# EAGLE design tsl3301cl_cs_mount (EAGLE 8.7.0)
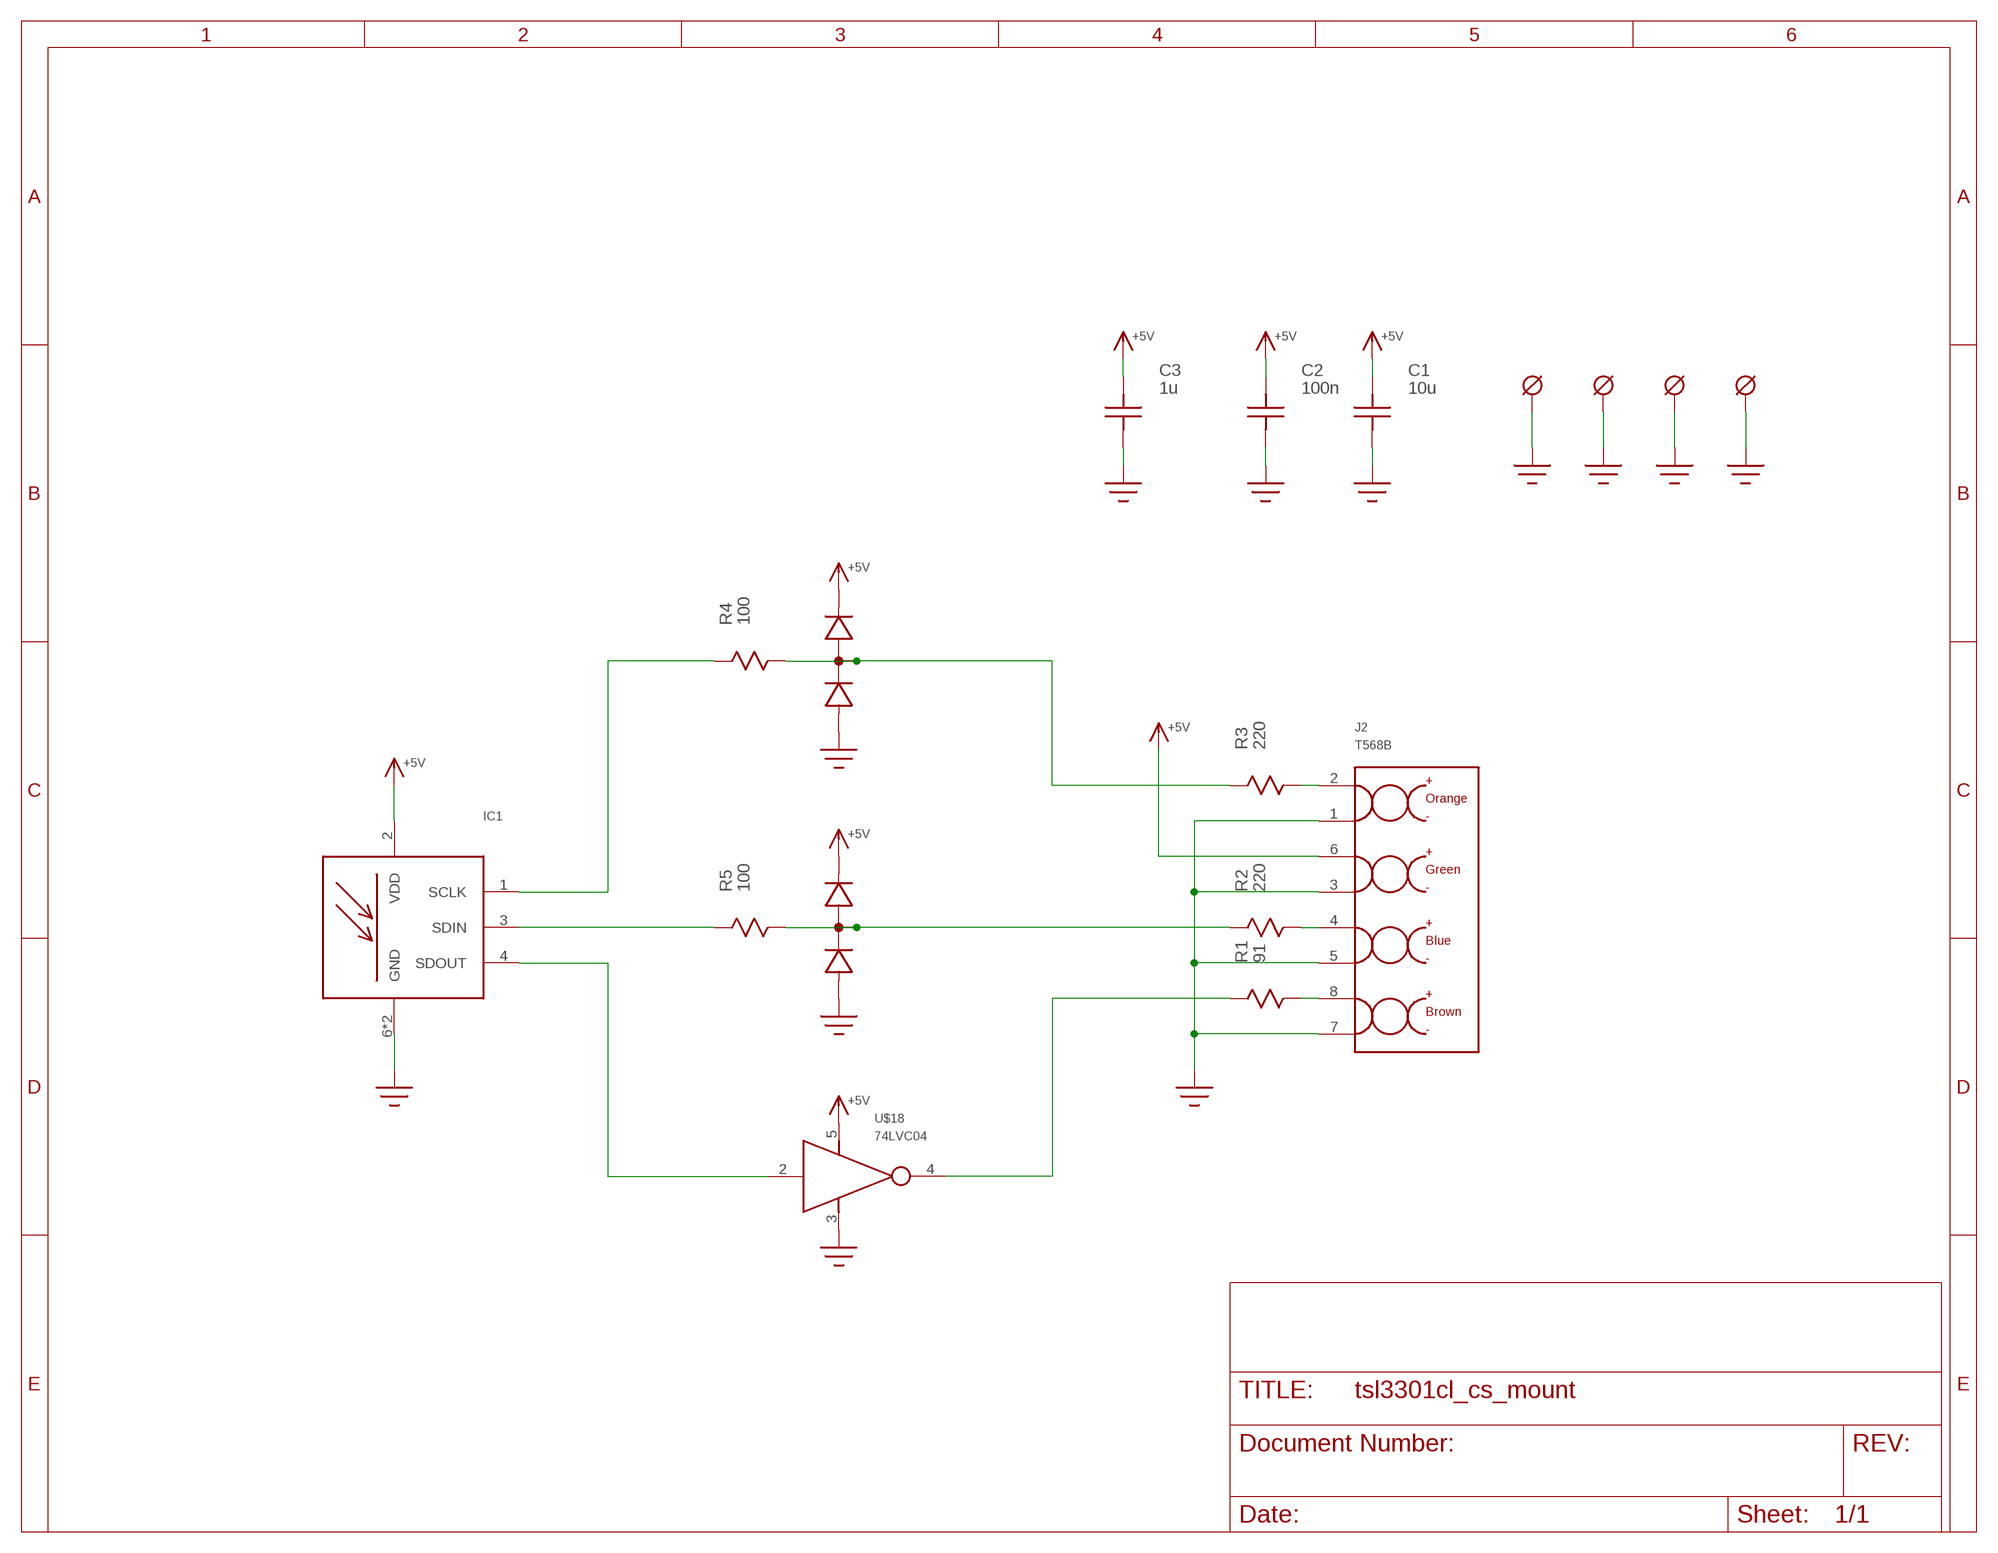
[diagram p0: schematic, sheet 1]

## Parts
C1  10u  C1206  [1206]
C2  100n  C0603  [C0603]
C3  1u  C0805  [0805]
IC1  TSL3301CL  [TSL3301]
J2  T568B  RJ45  [RJ45_KEYSTONE_949]
R1  91  R0805  [R0805]
R2  220  R0805  [R0805]
R3  220  R0805  [R0805]
R4  100  R0603  [R0603]
R5  100  R0603  [R0603]
U$2  MOUNTING_HOLE  [MOUNTING_HOLE_#4]
U$3  MOUNTING_HOLE  [MOUNTING_HOLE_#4]
U$4  MOUNTING_HOLE  [MOUNTING_HOLE_#4]
U$5  MOUNTING_HOLE  [MOUNTING_HOLE_#4]
U$18  74LVC04  [SOT23-5]
U$21  MMBD7000L  [SOT-23]
U$22  MMBD7000L  [SOT-23]

## Nets
+5V: C1.P$2 C2.P$2 C3.P$2 IC1.2(VDD) J2.6 U$18.5(VCC) U$21.2(CATHODE) U$22.2(CATHODE)
GND: C1.P$1 C2.P$1 C3.P$1 IC1.6(GND) IC1.7(GND) J2.1 J2.3 J2.5 J2.7 U$2.P$1 U$2.P$2 U$2.P$3 U$2.P$4 U$2.P$5 U$2.P$6 U$2.P$7 U$2.P$8 U$2.P$9 U$3.P$1 U$3.P$2 U$3.P$3 U$3.P$4 U$3.P$5 U$3.P$6 U$3.P$7 U$3.P$8 U$3.P$9 U$4.P$1 U$4.P$2 U$4.P$3 U$4.P$4 U$4.P$5 U$4.P$6 U$4.P$7 U$4.P$8 U$4.P$9 U$5.P$1 U$5.P$2 U$5.P$3 U$5.P$4 U$5.P$5 U$5.P$6 U$5.P$7 U$5.P$8 U$5.P$9 U$18.3(GND) U$21.1(ANODE) U$22.1(ANODE)
N$1: J2.8 R1.P$2
N$2: J2.2 R3.P$2
N$3: J2.4 R2.P$2
N$4: R1.P$1 U$18.4(OUT)
N$5: R2.P$1 R5.P$2 U$21.3(COMMON)
N$6: R3.P$1 R4.P$2 U$22.3(COMMON)
N$7: IC1.1(SCLK) R4.P$1
N$8: IC1.3(SDIN) R5.P$1
N$10: IC1.4(SDOUT) U$18.2(IN)

## Library data of the parts
C1-C3 = pancam:C
IC1 = pancam:TSL3301CL
J2 = pancam:RJ45
R1-R5 = pancam:R
U$2-U$5 = pancam:MOUNTING_HOLE
U$18 = pancam:74LVC04
U$21 U$22 = pancam:MMBD7000L

## Board
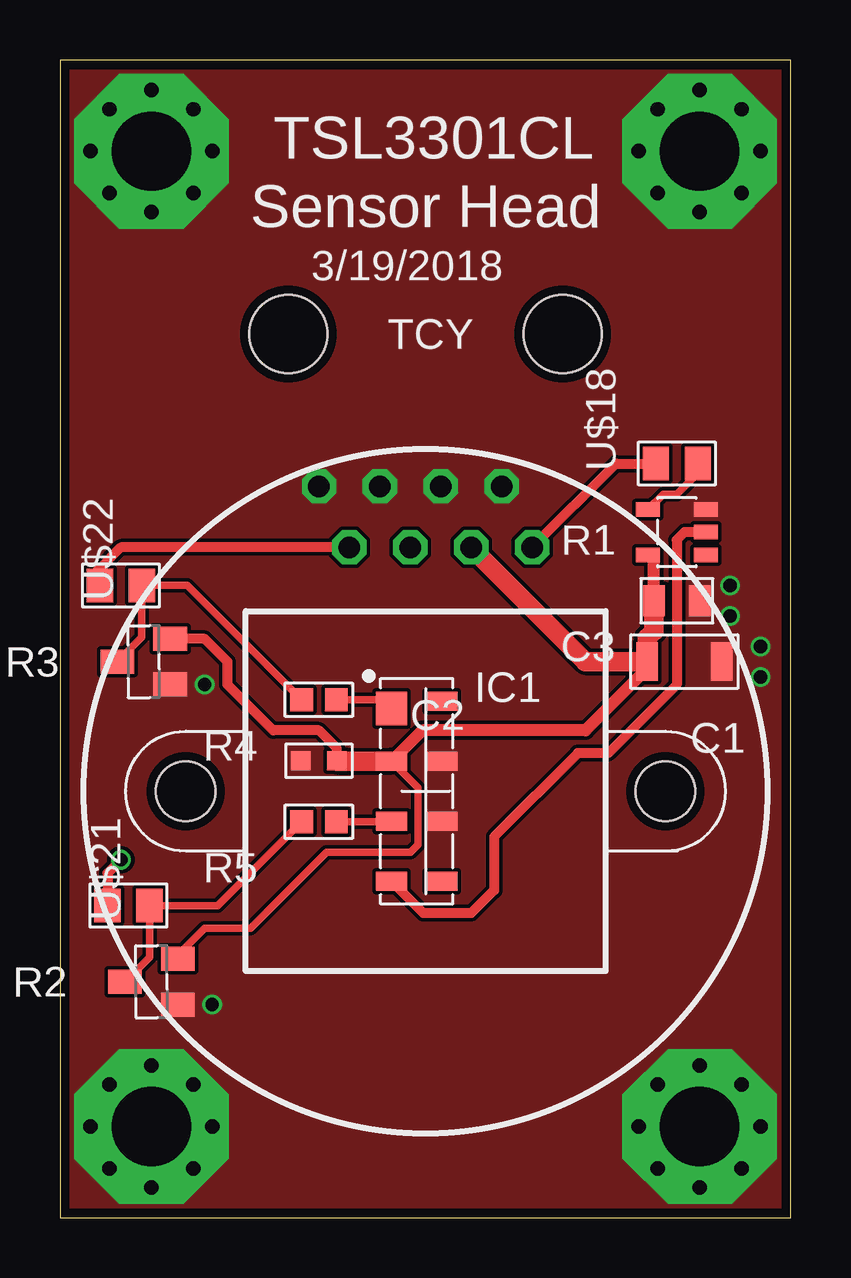
[diagram p1: board, top side]
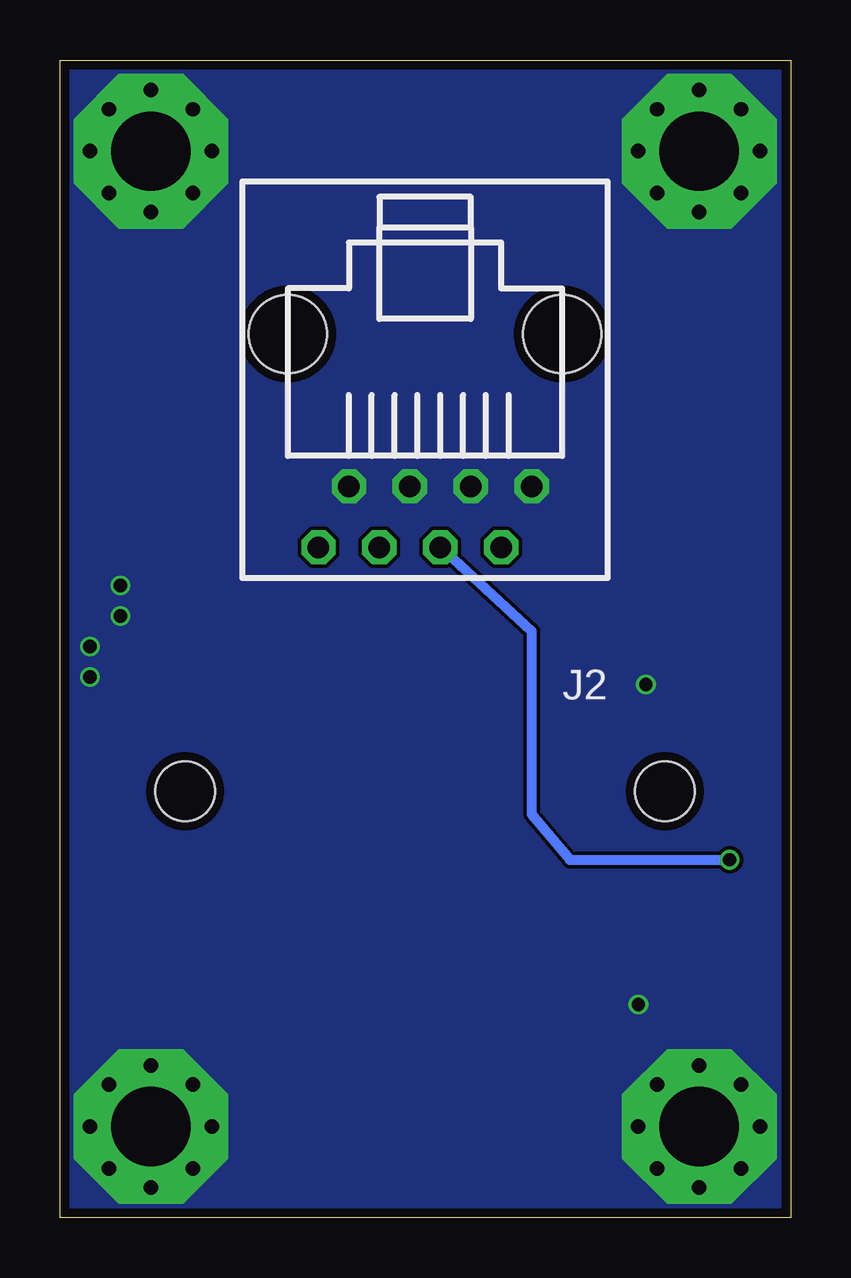
[diagram p2: board, bottom side, seen from below]

Size 30.46 x 48.25 mm. Coordinates in mm from the lower left corner, seen from the top.
Outline: 0,0 30.46,0 30.46,48.25 0,48.25 0,0
Copper layers (1*16): Top 0.035559375mm / dielectric 1.6mm / Bottom 0.035559375mm
Design rules "oshpark-2layer": minimum track width 6mil, minimum drill 10mil, track to track 6mil, track to pad 6mil, pad to pad 6mil, via to via 6mil, smd to smd 6mil, copper to edge 15mil, drill to drill 6mil, minimum pad ring 5mil, minimum via ring 5mil, stop-mask expansion 2.5mil, vias tented up to drill 0mil, thermal gap 10mil

### Footprints (pad centres in the part's own frame; a part is rotated, then mirrored left to right if it is on the bottom)
1206 = smd 0.9 x 1.6: P$1 -1.55,0; P$2 1.55,0
C0603 = smd 0.8 x 0.8: P$1 -0.75,0; P$2 0.75,0
0805 = smd 0.9 x 1.3: P$1 -0.95,0; P$2 0.95,0
TSL3301 = smd 1.3 x 1.4: 1 -1.05,3.45 | smd 1.3 x 0.8: 2 -1.05,1.25; 3 -1.05,-1.25; 4 -1.05,-3.75; 5 1.05,-3.75; 6 1.05,-1.25; 7 1.05,1.25; 8 1.05,3.75
RJ45_KEYSTONE_949 = drill 0.9 pad 1.422 octagon: 1 -4.445,0; 2 -3.175,2.54; 3 -1.905,0; 4 -0.635,2.54; 5 0.635,0; 6 1.905,2.54; 7 3.175,0; 8 4.445,2.54 | hole 3.251: -5.715,-6.35; 5.715,-6.35
R0805 = smd 1.1 x 1.4: P$1 -0.875,0; P$2 0.875,0
R0603 = smd 0.95 x 0.95: P$1 -0.725,0; P$2 0.725,0
CS_LENS_MOUNT = hole 2.5: -10,0; 10,0
MOUNTING_HOLE_#4 = drill 3.302 pad 6.452 octagon: P$1 0,0 | drill 0.6 pad 0.813 octagon: P$2 0,2.54; P$3 -2.54,0; P$4 2.54,0; P$5 0,-2.54; P$6 -1.746,1.746; P$7 1.746,1.746; P$8 -1.746,-1.746; P$9 1.746,-1.746
SOT23-5 = smd 0.6 x 1: 1 -0.95,-1.2; 2 0,-1.2; 3 0.95,-1.2; 4 0.95,1.2; 5 -0.95,1.2
SOT-23 = smd 1 x 1.4: 1 -0.95,-1.1; 2 0.95,-1.1; 3 0,1.1

### Placement (x,y rotation side)
C1  26.04,23.18 180 top
C2  10.79,19.05 0 top
C3  25.72,25.72 180 top
IC1  14.87,17.78 0 top
J2  15.24,30.48 180 bottom
R1  25.72,31.43 180 top
R2  2.86,13.02 180 top
R3  2.54,26.35 180 top
R4  10.79,21.59 180 top
R5  10.79,16.51 180 top
U$1  [CS_LENS_MOUNT]  15.24,17.78 0 top
U$2  3.81,3.81 0 top
U$3  3.81,44.45 0 top
U$4  26.67,3.81 0 top
U$5  26.67,44.45 0 top
U$18  25.72,28.57 90 top
U$21  3.81,9.84 90 top
U$22  3.49,23.18 90 top

### Tracks (layer width: path | path; a pad name or v marks a point on that pad's centre or on a via)
+5V
  Top 0.305: 13.95,19.03 IC1.2 14.92,17.93 14.92,15.56 14.61,15.24 11.11,15.24 7.94,12.06 6.03,12.06 4.91,10.94 U$21.2
  Top 0.406: C2.P$2 11.54,19.57 10.79,20.32 8.89,20.32 6.99,22.23 6.99,23.18 6.04,24.13 U$22.2
  Top 0.508: C3.P$2 24.77,27.38 U$18.5 | C1.P$2 24.48,22.9 21.91,20.32 15.11,20.32 13.95,19.16 13.95,19.03
  Top 0.813: C2.P$2 11.54,19.03 IC1.2 | J2.6 21.91,23.18 C1.P$2 24.48,24.17 24.77,24.45 C3.P$2
GND  (via drill 0.55)
  other vias: 6.03,22.23 6.35,8.89 27.94,26.35 27.94,25.08 29.21,23.81 29.21,22.54
  pour Top (no thermals): 0,0 30.48,0 30.48,48.26 0,48.26
  pour Bottom (no thermals): 0,0 30.48,0 30.48,48.26 0,48.26
N$1
  Top 0.406: J2.8 23.18,31.43 R1.P$2
N$2
  Top 0.305: 1.59,26.99 1.67,26.91 R3.P$2
  Top 0.406: J2.2 2.54,27.94 1.59,26.99
N$3  (via drill 0.55)
  Top 0.406: v2.54,14.92 1.98,14.37 R2.P$2
  Bottom 0.406: v2.54,14.92 9.21,14.92 10.79,16.83 10.79,24.45 J2.4
N$4
  Top 0.305: U$18.4 25.16,30.16 25.72,30.16 26.59,31.04 R1.P$1
N$5
  Top 0.305: R5.P$2 6.58,13.02 R2.P$1 3.73,10.87 U$21.3
N$6
  Top 0.305: U$22.3 3.42,24.2 R3.P$1 5.31,26.35 R4.P$2
N$7
  Top 0.305: R4.P$1 13.82,21.59 IC1.1
N$8
  Top 0.305: R5.P$1 13.82,16.51 IC1.3
N$10
  Top 0.406: U$18.2 26.04,28.57 25.72,28.26 25.72,22.23 22.86,19.37 21.59,19.37 18.1,15.88 18.1,13.65 17.14,12.7 15.15,12.7 IC1.4

### Text on the board
tPlace: TSL3301CL | Sensor Head | 3/19/2018 | TCY